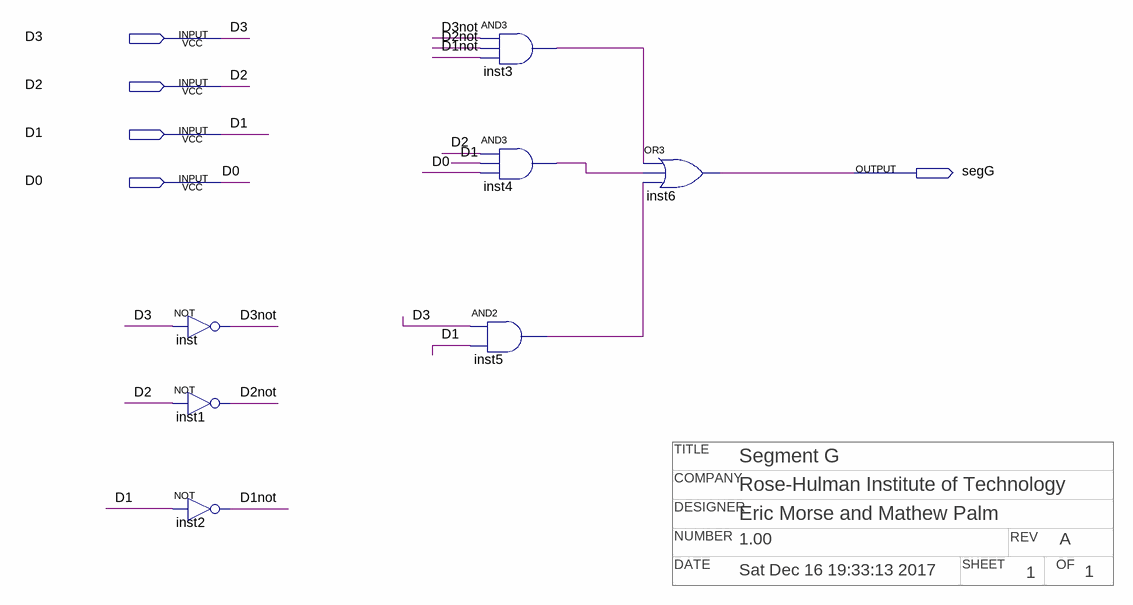
[diagram p0: schematic sheet]
// Quartus schematic segG.bdf as structural Verilog: 7 symbols, 5 pins
// Title block: COMPANY: Rose-Hulman Institute of Technology; DATE: Sat Dec 16 19:33:13 2017; DESIGNER: Eric Morse and Mathew Palm; NUMBER: 1.00; OF: 1; REV: A; SHEET: 1; TITLE: Segment G
module segG (
  input  D3,
  input  D2,
  input  D1,
  input  D0,
  output segG
);

  wire D1not, D2not, D3not, inst3_out, inst4_out, inst5_out;

  not inst (D3not, D3);
  not inst1 (D2not, D2);
  not inst2 (D1not, D1);
  and inst3 (inst3_out, D3not, D2not, D1not);
  and inst4 (inst4_out, D2, D1, D0);
  and inst5 (inst5_out, D3, D1);
  or inst6 (segG, inst3_out, inst4_out, inst5_out);
endmodule
